# EAGLE board surfaceRX (EAGLE 6.2), part 1 of 2
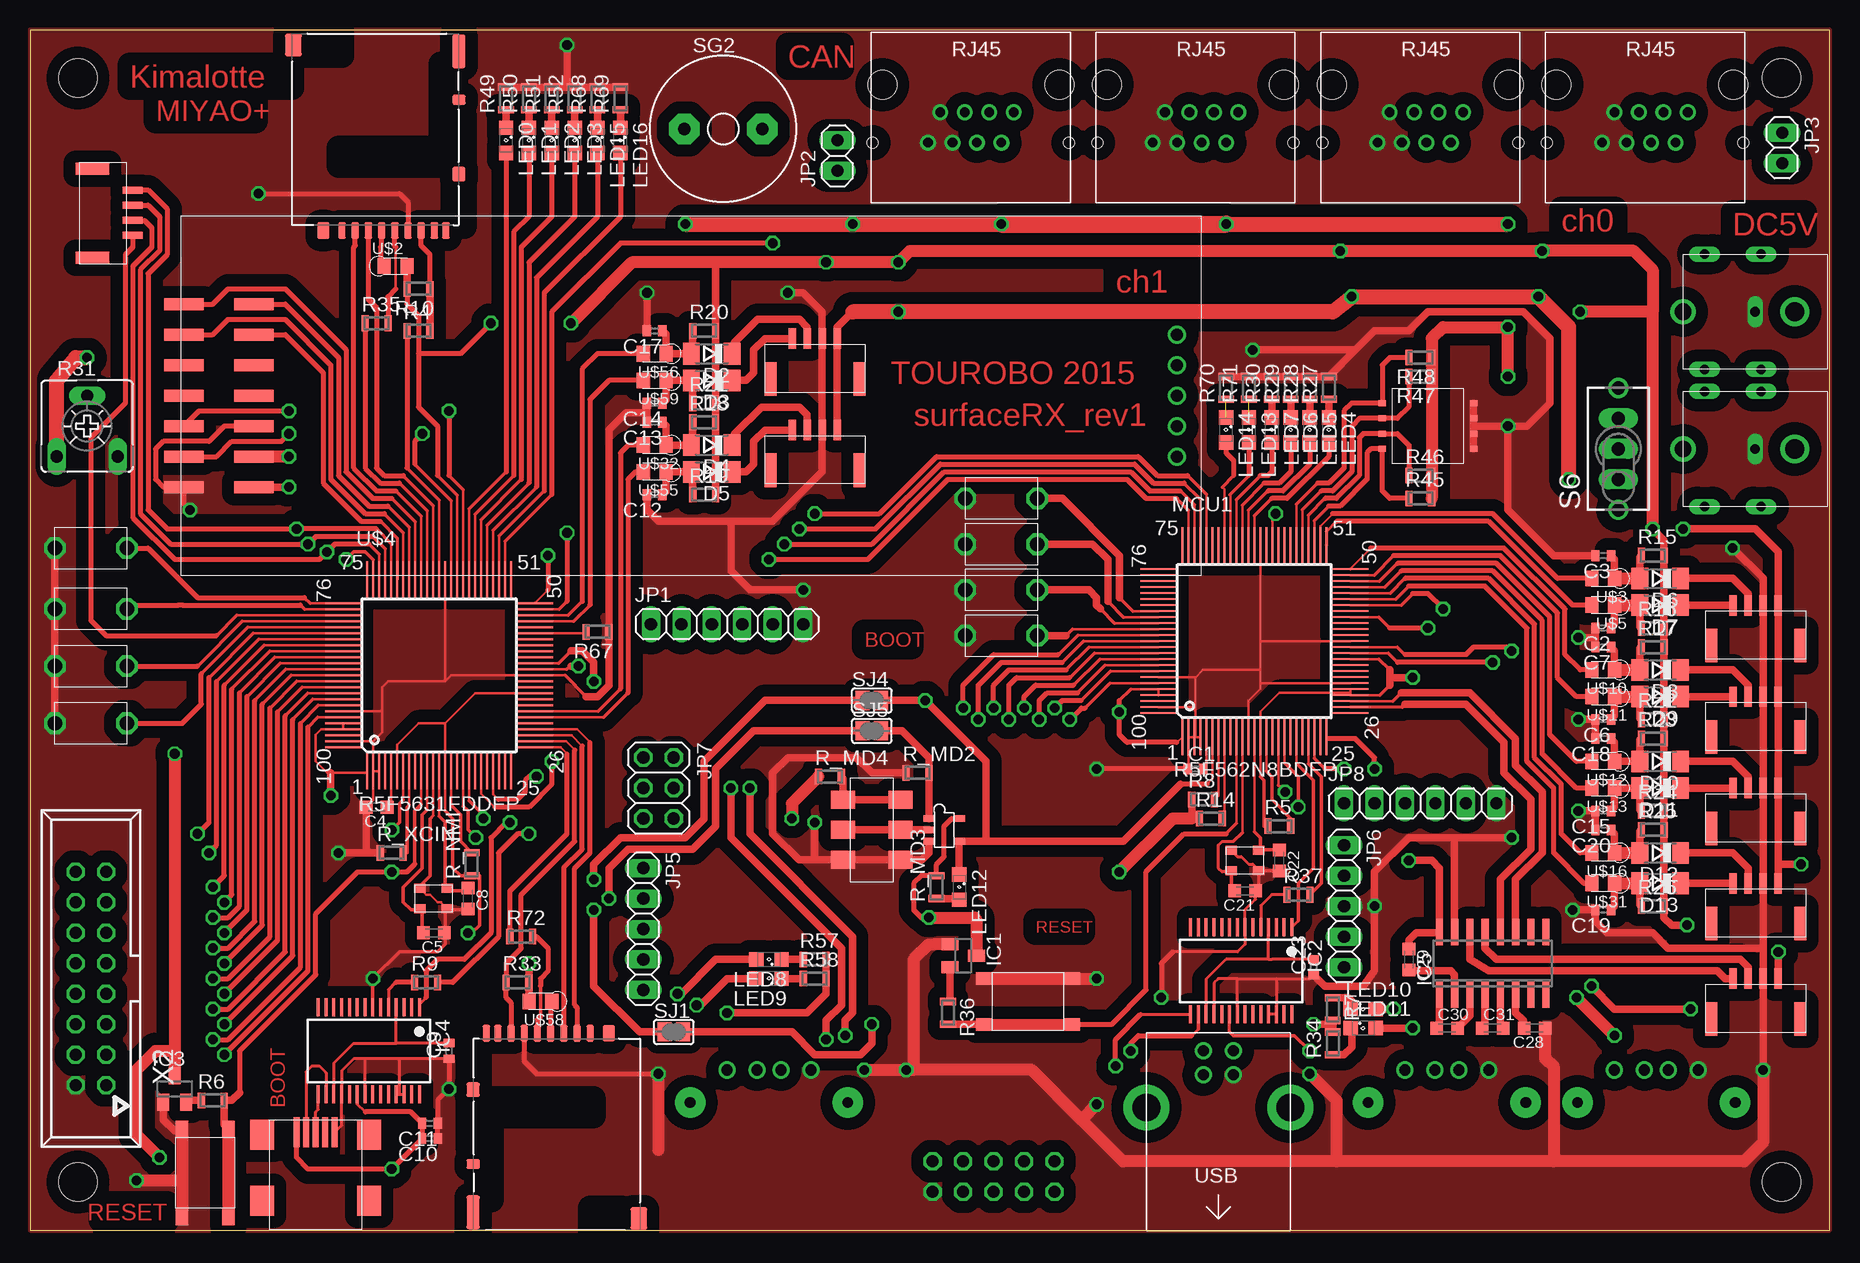
[diagram p2: board, top side]
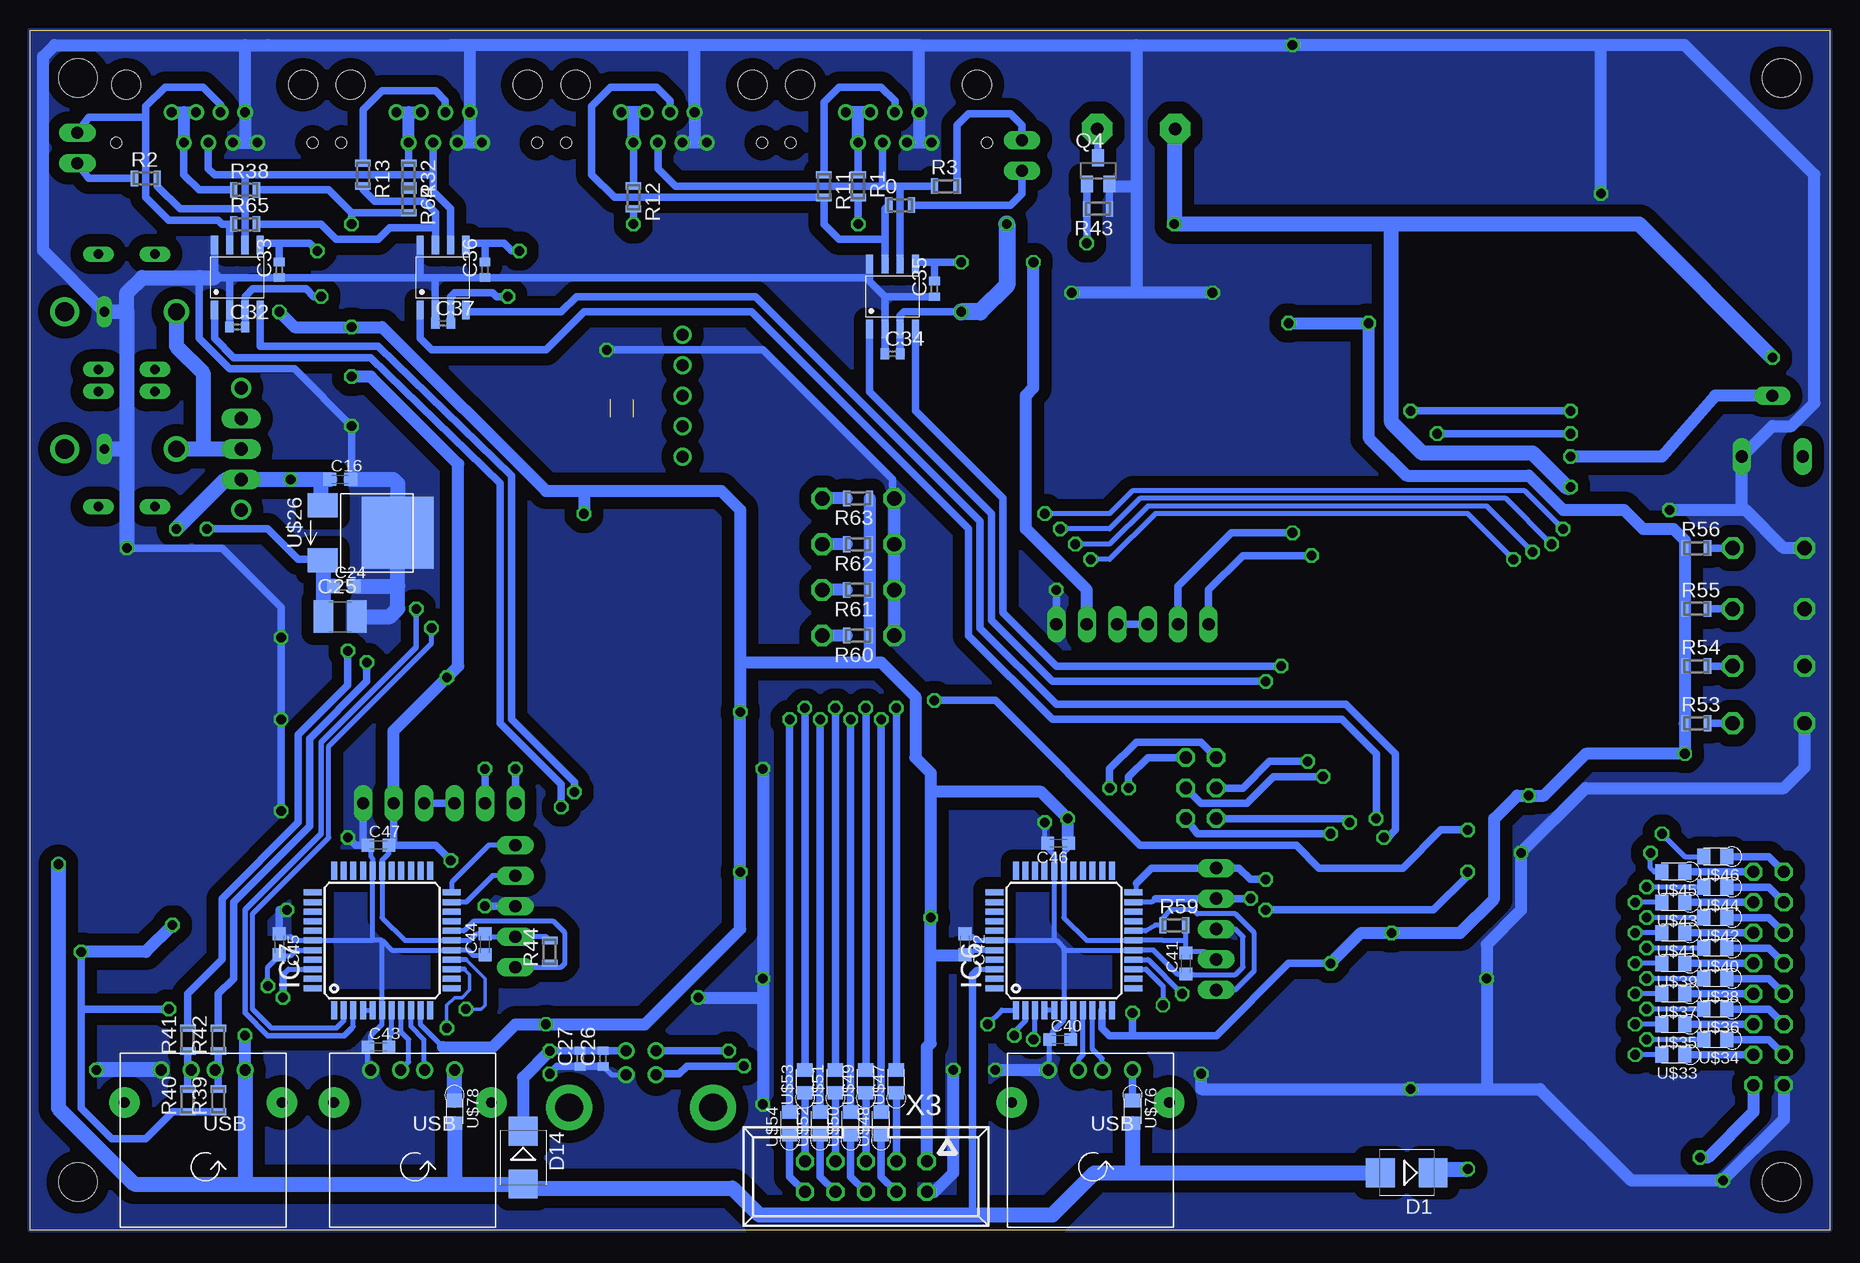
[diagram p3: board, bottom side, seen from below]

Size 150 x 100 mm. Coordinates in mm from the lower left corner, seen from the top.
Outline: 0,0 150,0 150,100 0,100 0,0
Copper layers (1*16): Top 0.035mm / dielectric 1.5mm / Bottom 0.035mm
Design rules "default": minimum track width 0.2mm, minimum drill 24mil, track to track 8mil, track to pad 8mil, pad to pad 8mil, via to via 8mil, smd to smd 0mil, copper to edge 0mil, drill to drill 8mil, minimum pad ring 10mil, minimum via ring 8mil, stop-mask expansion 4mil, vias tented up to drill 0mil, thermal gap 10mil
Holes 3.2 mm at 4,96 4,4 146,4 146,96

## Footprints (pad centres in the part's own frame; a part is rotated, then mirrored left to right if it is on the bottom)
MINI_MELF-0102W = smd 0.6 x 1.3: 1 -0.95,0; 2 0.95,0
C0402 = smd 0.7 x 0.9: 1 -0.65,0; 2 0.65,0
C0603K = smd 1.05 x 1.08: 1 -0.875,0; 2 0.875,0
C3225 = smd 1.6 x 2.7: 1 -1.4,0; 2 1.4,0
SMB = smd 2.4 x 2.4: A 2.2,0; C -2.2,0
SOD80C = smd 1.4 x 1.8: A 1.7,0; C -1.7,0
SOT23B-3 = smd 1 x 1.4: 1 -0.95,-1.1; 2 0.95,-1.1; 3 0,1.1
SSOP28 = smd 0.25 x 1.5: 1 -4.225,-3.625; 2 -3.575,-3.625; 3 -2.925,-3.625; 4 -2.275,-3.625; 5 -1.625,-3.625; 6 -0.975,-3.625; 7 -0.325,-3.625; 8 0.325,-3.625; 9 0.975,-3.625; 10 1.625,-3.625; 11 2.275,-3.625; 12 2.925,-3.625; 13 3.575,-3.625; 14 4.225,-3.625; 15 4.225,3.625; 16 3.575,3.625; 17 2.925,3.625; 18 2.275,3.625; 19 1.625,3.625; 20 0.975,3.625; 21 0.325,3.625; 22 -0.325,3.625; 23 -0.975,3.625; 24 -1.625,3.625; 25 -2.275,3.625; 26 -2.925,3.625; 27 -3.575,3.625; 28 -4.225,3.625
SO16 = smd 0.6 x 2.2: 1 -4.445,-2.6; 2 -3.175,-2.6; 3 -1.905,-2.6; 4 -0.635,-2.6; 5 0.635,-2.6; 6 1.905,-2.6; 7 3.175,-2.6; 8 4.445,-2.6; 9 4.445,2.6; 10 3.175,2.6; 11 1.905,2.6; 12 0.635,2.6; 13 -0.635,2.6; 14 -1.905,2.6; 15 -3.175,2.6; 16 -4.445,2.6
TQFP44 = smd 1.5 x 0.5: 1 -5.8,4; 2 -5.8,3.2; 3 -5.8,2.4; 4 -5.8,1.6; 5 -5.8,0.8; 6 -5.8,0; 7 -5.8,-0.8; 8 -5.8,-1.6; 9 -5.8,-2.4; 10 -5.8,-3.2; 11 -5.8,-4; 23 5.8,-4; 24 5.8,-3.2; 25 5.8,-2.4; 26 5.8,-1.6; 27 5.8,-0.8; 28 5.8,0; 29 5.8,0.8; 30 5.8,1.6; 31 5.8,2.4; 32 5.8,3.2; 33 5.8,4 | smd 0.5 x 1.5: 12 -4,-5.8; 13 -3.2,-5.8; 14 -2.4,-5.8; 15 -1.6,-5.8; 16 -0.8,-5.8; 17 0,-5.8; 18 0.8,-5.8; 19 1.6,-5.8; 20 2.4,-5.8; 21 3.2,-5.8; 22 4,-5.8; 34 4,5.8; 35 3.2,5.8; 36 2.4,5.8; 37 1.6,5.8; 38 0.8,5.8; 39 0,5.8; 40 -0.8,5.8; 41 -1.6,5.8; 42 -2.4,5.8; 43 -3.2,5.8; 44 -4,5.8
1X06 = drill 1.016 long: 1 -6.35,0; 2 -3.81,0; 3 -1.27,0; 4 1.27,0; 5 3.81,0; 6 6.35,0
1X02 = drill 1.016 long: 1 -1.27,0; 2 1.27,0
1X05 = drill 1.016 long: 1 -5.08,0; 2 -2.54,0; 3 0,0; 4 2.54,0; 5 5.08,0
2X03 = drill 1.016 octagon: 1 -2.54,-1.27; 2 -2.54,1.27; 3 0,-1.27; 4 0,1.27; 5 2.54,-1.27; 6 2.54,1.27
SML0805 = smd 1.2 x 1.2: A 1.05,0; C -1.05,0
LQFP100 = smd 0.15 x 3: 1 -6.5,-7.5; 2 -6,-7.5; 3 -5.5,-7.5; 4 -5,-7.5; 5 -4.5,-7.5; 6 -4,-7.5; 7 -3.5,-7.5; 8 -3,-7.5; 9 -2.5,-7.5; 10 -2,-7.5; 11 -1.5,-7.5; 12 -1,-7.5; 13 -0.5,-7.5; 14 0,-7.5; 15 0.5,-7.5; 16 1,-7.5; 17 1.5,-7.5; 18 2,-7.5; 19 2.5,-7.5; 20 3,-7.5; 21 3.5,-7.5; 22 4,-7.5; 23 4.5,-7.5; 24 5,-7.5; 25 5.5,-7.5; 51 5.5,8.5; 52 5,8.5; 53 4.5,8.5; 54 4,8.5; 55 3.5,8.5; 56 3,8.5; 57 2.5,8.5; 58 2,8.5; 59 1.5,8.5; 60 1,8.5; 61 0.5,8.5; 62 0,8.5; 63 -0.5,8.5; 64 -1,8.5; 65 -1.5,8.5; 66 -2,8.5; 67 -2.5,8.5; 68 -3,8.5; 69 -3.5,8.5; 70 -4,8.5; 71 -4.5,8.5; 72 -5,8.5; 73 -5.5,8.5; 74 -6,8.5; 75 -6.5,8.5 | smd 3 x 0.15: 26 7.5,-5.5; 27 7.5,-5; 28 7.5,-4.5; 29 7.5,-4; 30 7.5,-3.5; 31 7.5,-3; 32 7.5,-2.5; 33 7.5,-2; 34 7.5,-1.5; 35 7.5,-1; 36 7.5,-0.5; 37 7.5,0; 38 7.5,0.5; 39 7.5,1; 40 7.5,1.5; 41 7.5,2; 42 7.5,2.5; 43 7.5,3; 44 7.5,3.5; 45 7.5,4; 46 7.5,4.5; 47 7.5,5; 48 7.5,5.5; 49 7.5,6; 50 7.5,6.5; 76 -8.5,6.5; 77 -8.5,6; 78 -8.5,5.5; 79 -8.5,5; 80 -8.5,4.5; 81 -8.5,4; 82 -8.5,3.5; 83 -8.5,3; 84 -8.5,2.5; 85 -8.5,2; 86 -8.5,1.5; 87 -8.5,1; 88 -8.5,0.5; 89 -8.5,0; 90 -8.5,-0.5; 91 -8.5,-1; 92 -8.5,-1.5; 93 -8.5,-2; 94 -8.5,-2.5; 95 -8.5,-3; 96 -8.5,-3.5; 97 -8.5,-4; 98 -8.5,-4.5; 99 -8.5,-5; 100 -8.5,-5.5
SOT23 = smd 1 x 1.4: 1 -0.95,-1.1; 2 0.95,-1.1; 3 0,1.1
CA6V = drill 1.016 long: A -2.54,-2.54; E 2.54,-2.54; S 0,2.54
TL3XYO = drill 1.1 pad 1.422 long: 1 -2.54,0; 2 0,0; 3 2.54,0 | drill 1.1 pad 1.676: M1 -5.08,0; M2 5.08,0
AL60P = drill 1.016 pad 2.54 octagon: 1 -3.251,0; 2 3.251,0
SJ = smd 1.168 x 1.6: 1 -0.762,0; 2 0.762,0
GHTOP4 = smd 0.6 x 1.7: 1 1.25,4.75; 2 0,4.75; 3 -1.25,4.75; 4 -2.5,4.75 | smd 1 x 2.8: P$1 3.1,1.4; P$2 -4.3,1.4
2012 = smd 1.1 x 1.3: 1 -0.95,0; 2 0.95,0
TSHA-T-2 = smd 1.4 x 1.05: A -3.65,1.925; B 3.65,1.925; C -3.65,-1.925; D 3.65,-1.925
MUSB-5BF02AS-N = smd 0.5 x 2.5: 1 1.6,1.05; 2 0.8,1.05; 3 0,1.05; 4 -0.8,1.05; 5 -1.6,1.05 | smd 2 x 2.5: P$6 4.45,1.25; P$7 -4.45,1.25; P$8 4.45,6.75; P$9 -4.45,6.75
MCP2562 = smd 1.55 x 0.6: 1 -2.7,2.54; 2 -2.7,1.27; 3 -2.7,0; 4 -2.7,-1.27; 5 2.7,-1.27; 6 2.7,0; 7 2.7,1.27; 8 2.7,2.54
RJ45 = drill 0.8: P$1 -3.57,-0.44; P$2 -2.55,2.1; P$3 -1.53,-0.44; P$4 -0.51,2.1; P$5 0.51,-0.44; P$6 1.53,2.1; P$7 2.55,-0.44; P$8 3.57,2.1 | hole 2.4: -7.375,-2.74; 7.375,-2.74 | hole 0.9: -8.175,2.1; 8.175,2.1
2DC-G213-B66 = drill 1.4: 1 0,0 | drill 0.8 long: 2 0,6; P$4 -4.8,6.5; P$5 -4.8,1.8; P$6 4.8,1.8; P$7 4.8,6.5 | drill 1.6: P$3 0,9.3
TO-252-3-L1 = smd 2 x 2.5: 1 -2.3,-4; 3 2.3,-4 | smd 6 x 6: 2 0,2.25
DM3AT-SF-PEJ = smd 0.65 x 1.4: 1 3.2,16.4; 2 2.1,16.4; 3 1,16.4; 4 -0.1,16.4; 5 -1.2,16.4; 6 -2.3,16.4; 7 -3.4,16.4; 8 -4.5,16.4; CD1 -5.45,16.4 | smd 1.1 x 0.8: CD2 -6.55,5.5 | smd 1.1 x 2.8: GND1 -6.55,1.475 | smd 1.4 x 1.9: GND2 7.25,0.95 | smd 1 x 1.4: GND3 4.75,16.4 | smd 1.1 x 1.2: GND4 -6.55,11.7
FA238V = smd 0.95 x 0.75: 1 -1.15,-0.85; 2 1.15,-0.85; 3 1.15,0.85; 4 -1.15,0.85
USB-TYPEB = drill 0.92 pad 1.422: 1 1.25,0; 2 -1.25,0; 3 -1.25,-2; 4 1.25,-2 | drill 2.3 pad 3.81: P$5 -6,-4.71; P$6 6,-4.71
SC1602BBWB_PAD = smd 3.3 x 1: 1 4.064,0; 2 -1.778,0; 3 4.064,2.54; 4 -1.778,2.54; 5 4.064,5.08; 6 -1.778,5.08; 7 4.064,7.62; 8 -1.778,7.62; 9 4.064,10.16; 10 -1.778,10.16; 11 4.064,12.7; 12 -1.778,12.7; 13 4.064,15.24; 14 -1.778,15.24 | drill 1: P$1 81,12.7; P$2 81,10.16; P$3 81,7.62; P$4 81,5.08; P$5 81,2.54
TVBP06 = drill 1.2 octagon: 1 0,3; 2 0,-3
USB_A = drill 0.92: 1 3.5,0; 2 1,0; 3 -1,0; 4 -3.5,0 | drill 0.9 pad 2.54: PAD@1 6.57,-2.71; PAD@2 -6.57,-2.71
SOT23-5 = smd 0.57 x 0.95: 1 -0.95,-1.25; 2 0,-1.25; 3 0.95,-1.25; 4 0.95,1.25; 5 -0.95,1.25
KHS42 = smd 0.5 x 0.6: 1 -1.905,3.81; 2 -0.635,3.81; 3 0.635,3.81; 4 1.905,3.81; 5 -1.905,-3.81; 6 -0.635,-3.81; 7 0.635,-3.81; 8 1.905,-3.81
SSSS2 = smd 1.5 x 2: 1 -2.5,2.4; 2 0,2.4; 3 2.5,2.4; 4 -2.5,-2.4; 5 0,-2.4; 6 2.5,-2.4
057-016-1 = drill 1 octagon: 1 -8.89,-1.27; 2 -8.89,1.27; 3 -6.35,-1.27; 4 -6.35,1.27; 5 -3.81,-1.27; 6 -3.81,1.27; 7 -1.27,-1.27; 8 -1.27,1.27; 9 1.27,-1.27; 10 1.27,1.27; 11 3.81,-1.27; 12 3.81,1.27; 13 6.35,-1.27; 14 6.35,1.27; 15 8.89,-1.27; 16 8.89,1.27
057-010-1 = drill 1 octagon: 1 -5.08,-1.27; 2 -5.08,1.27; 3 -2.54,-1.27; 4 -2.54,1.27; 5 0,-1.27; 6 0,1.27; 7 2.54,-1.27; 8 2.54,1.27; 9 5.08,-1.27; 10 5.08,1.27

## Placement (x,y rotation side)
0  120  [MINI_MELF-0102W]  77.47,85.41 0 bottom
C1  0.1u  [C0402]  97.16,38.42 0 top
C2  0.01u  [C0402]  131.13,50.16 180 top
C3  0.01u  [C0402]  131.13,56.2 180 top
C4  0.1uF  [C0603K]  28.89,35.24 180 top
C5  22p  [C0603K]  33.66,24.77 180 top
C6  0.01u  [C0402]  131.13,42.55 180 top
C7  0.01u  [C0402]  131.13,48.58 180 top
C8  22p  [C0603K]  36.51,27.62 270 top
C9  0.1u  [C0402]  34.92,14.92 90 top
C10  0.1u  [C0402]  33.34,7.62 180 top
C11  0.1u  [C0402]  33.34,8.89 180 top
C12  0.01u  [C0402]  52.07,61.28 180 top
C13  0.01u  [C0402]  52.07,67.31 180 top
C14  0.01u  [C0402]  52.07,68.9 180 top
C15  0.01u  [C0402]  131.13,34.92 180 top
C16  0.1uF  [C0603K]  124.14,62.55 0 bottom
C17  0.01u  [C0402]  52.07,74.93 180 top
C18  0.01u  [C0402]  131.13,40.96 180 top
C19  0.01u  [C0402]  131.13,26.67 180 top
C20  0.01u  [C0402]  131.13,33.34 180 top
C21  22p  [C0603K]  101.28,28.26 180 top
C22  22p  [C0603K]  104.14,30.8 270 top
C23  0.1u  [C0402]  107,21.91 90 top
C24  0.1uF  [C0603K]  123.83,53.66 0 bottom
C25  47u  [C3225]  124.14,51.12 0 bottom
C26  0.1u  [C0402]  102.23,14.29 90 bottom
C27  0.1u  [C0402]  104.14,14.29 90 bottom
C28  0.1uF  [C0603K]  125.41,16.83 180 top
C29  0.1uF  [C0603K]  114.94,22.54 270 top
C30  0.1uF  [C0603K]  118.11,16.83 0 top
C31  0.1uF  [C0603K]  121.92,16.83 0 top
C32  0.1u  [C0402]  132.72,75.25 0 bottom
C33  0.1u  [C0402]  129.22,80.01 90 bottom
C34  0.1u  [C0402]  78.11,73.03 0 bottom
C35  0.1u  [C0402]  74.61,78.42 90 bottom
C36  0.1u  [C0402]  112.08,80.01 90 bottom
C37  0.1u  [C0402]  115.57,75.56 0 bottom
C40  10u  [C0603K]  64.14,15.88 0 bottom
C41  0.1u  [C0603K]  53.66,22.23 90 bottom
C42  0.1u  [C0603K]  72.07,23.81 270 bottom
C43  10u  [C0603K]  120.97,15.24 0 bottom
C44  0.1uu  [C0603K]  112.08,23.81 90 bottom
C45  0.1u  [C0603K]  129.22,23.81 270 bottom
C46  0.1u  [C0603K]  64.29,32.23 180 bottom
C47  0.1u  [C0603K]  120.97,32.07 0 bottom
D1  ES2D  [SMB]  35.24,4.76 180 bottom
D2  PMLL4150  [SOD80C]  56.83,73.03 180 top
D3  PMLL4150  [SOD80C]  56.83,70.8 180 top
D4  PMLL4150  [SOD80C]  56.83,65.41 180 top
D5  PMLL4150  [SOD80C]  56.83,63.18 180 top
D6  PMLL4150  [SOD80C]  135.89,54.29 180 top
D7  PMLL4150  [SOD80C]  135.89,52.07 180 top
D8  PMLL4150  [SOD80C]  135.89,46.67 180 top
D9  PMLL4150  [SOD80C]  135.89,44.45 180 top
D10  PMLL4150  [SOD80C]  135.89,39.05 180 top
D11  PMLL4150  [SOD80C]  135.89,36.83 180 top
D12  PMLL4150  [SOD80C]  135.89,31.43 180 top
D13  PMLL4150  [SOD80C]  135.89,28.89 180 top
D14  ES2D  [SMB]  108.9,6.03 270 bottom
IC1  [SOT23B-3]  77.79,22.86 270 top
IC2  FT232RL  [SSOP28]  100.97,21.59 180 top
IC3  [SOT23B-3]  12.06,11.75 0 top
IC4  FT232RL  [SSOP28]  28.26,14.92 180 top
IC5  ADM3202ARN  [SO16]  121.92,22.23 0 top
IC6  PIC24FJ64GA004  [TQFP44]  63.82,24.13 90 bottom
IC7  PIC24FJ64GA004  [TQFP44]  120.65,24.13 90 bottom
JP1  [1X06]  58.1,50.48 0 top
JP2  [1X02]  67.31,89.53 90 top
JP3  [1X02]  146.05,90.17 270 top
JP5  [1X05]  51.12,25.08 270 top
JP6  [1X05]  109.54,26.99 270 top
JP7  [2X03]  52.39,36.83 270 top
JP8  [1X06]  115.89,35.56 0 top
LED0  [SML0805]  39.69,90.81 270 top
LED1  [SML0805]  41.59,90.81 270 top
LED2  [SML0805]  43.5,90.81 270 top
LED3  [SML0805]  45.4,90.81 270 top
LED4  [SML0805]  108.27,66.67 270 top
LED5  [SML0805]  106.68,66.67 270 top
LED6  [SML0805]  105.09,66.67 270 top
LED7  [SML0805]  103.5,66.67 270 top
LED8  [SML0805]  61.59,22.54 180 top
LED9  [SML0805]  61.59,20.95 180 top
LED10  [SML0805]  111.12,18.41 0 top
LED11  [SML0805]  111.12,16.83 0 top
LED12  [SML0805]  77.47,28.57 270 top
LED13  [SML0805]  101.6,66.67 270 top
LED14  [SML0805]  99.69,66.67 270 top
LED15  [SML0805]  47.31,90.81 270 top
LED16  [SML0805]  49.21,90.81 270 top
MCU1  R5F562N8BDFP  [LQFP100]  102.55,48.58 0 top
Q4  [SOT23]  60.96,88.27 0 bottom
R1  0  [MINI_MELF-0102W]  80.96,87 270 bottom
R2  120  [MINI_MELF-0102W]  140.34,87.63 0 bottom
R3  0  [MINI_MELF-0102W]  73.66,87 0 bottom
R4  0  [MINI_MELF-0102W]  32.38,74.93 0 top
R5  4.7k  [MINI_MELF-0102W]  104.14,33.66 0 top
R6  4.7k  [MINI_MELF-0102W]  15.24,10.79 0 top
R7  1k  [MINI_MELF-0102W]  108.58,18.41 270 top
R8  4.7k  [MINI_MELF-0102W]  97.79,35.88 0 top
R9  0  [MINI_MELF-0102W]  33.02,20.64 0 top
R10  10k  [MINI_MELF-0102W]  32.38,78.42 180 top
R11  0  [MINI_MELF-0102W]  83.82,87 270 bottom
R12  0  [MINI_MELF-0102W]  99.69,86.04 270 bottom
R13  0  [MINI_MELF-0102W]  122.24,87.95 270 bottom
R14  4.7k  [MINI_MELF-0102W]  98.42,34.29 0 top
R15  200  [MINI_MELF-0102W]  135.25,56.2 0 top
R16  200  [MINI_MELF-0102W]  135.25,50.16 0 top
R17  200  [MINI_MELF-0102W]  135.25,48.58 0 top
R18  200  [MINI_MELF-0102W]  56.2,67.31 0 top
R19  200  [MINI_MELF-0102W]  56.2,61.28 0 top
R20  200  [MINI_MELF-0102W]  56.2,74.93 0 top
R21  200  [MINI_MELF-0102W]  56.2,68.9 0 top
R22  200  [MINI_MELF-0102W]  135.25,42.55 0 top
R23  200  [MINI_MELF-0102W]  135.25,40.96 0 top
R24  200  [MINI_MELF-0102W]  135.25,34.92 0 top
R25  200  [MINI_MELF-0102W]  135.25,33.34 0 top
R26  200  [MINI_MELF-0102W]  135.25,26.99 0 top
R27  1k  [MINI_MELF-0102W]  108.27,70.17 90 top
R28  1k  [MINI_MELF-0102W]  106.68,70.17 90 top
R29  1k  [MINI_MELF-0102W]  105.09,70.17 90 top
R30  1k  [MINI_MELF-0102W]  103.5,70.17 90 top
R31  10k  [CA6V]  4.76,66.99 0 top
R32  0  [MINI_MELF-0102W]  118.43,87.95 270 bottom
R33  10k  [MINI_MELF-0102W]  40.64,20.64 0 top
R34  1k  [MINI_MELF-0102W]  108.58,15.56 90 top
R35  0  [MINI_MELF-0102W]  28.89,75.56 0 top
R36  4.7k  [MINI_MELF-0102W]  76.52,18.1 270 top
R37  0  [MINI_MELF-0102W]  105.73,27.94 0 top
R38  0  [MINI_MELF-0102W]  132.08,86.68 0 bottom
R39  15k  [MINI_MELF-0102W]  134.3,10.79 90 bottom
R40  15k  [MINI_MELF-0102W]  136.84,10.79 90 bottom
R41  22  [MINI_MELF-0102W]  136.84,15.88 90 bottom
R42  22  [MINI_MELF-0102W]  134.3,15.88 90 bottom
R43  10k  [MINI_MELF-0102W]  60.96,85.09 180 bottom
R44  10k  [MINI_MELF-0102W]  106.68,23.18 90 bottom
R45  10k  [MINI_MELF-0102W]  115.89,60.96 0 top
R46  10k  [MINI_MELF-0102W]  115.89,62.87 0 top
R47  10k  [MINI_MELF-0102W]  115.89,71.12 180 top
R48  10k  [MINI_MELF-0102W]  115.89,72.71 180 top
R49  1k  [MINI_MELF-0102W]  39.69,94.3 90 top
R50  1k  [MINI_MELF-0102W]  41.59,94.3 90 top
R51  1k  [MINI_MELF-0102W]  43.5,94.3 90 top
R52  1k  [MINI_MELF-0102W]  45.4,94.3 90 top
R53  10k  [MINI_MELF-0102W]  11.11,42.23 0 bottom
R54  10k  [MINI_MELF-0102W]  11.11,46.99 0 bottom
R55  10k  [MINI_MELF-0102W]  11.11,51.75 0 bottom
R56  10k  [MINI_MELF-0102W]  11.11,56.83 0 bottom
R57  1k  [MINI_MELF-0102W]  65.41,22.54 0 top
R58  1k  [MINI_MELF-0102W]  65.41,20.95 0 top
R59  10k  [MINI_MELF-0102W]  54.61,25.4 0 bottom
R60  1k  [MINI_MELF-0102W]  80.96,49.53 180 bottom
R61  1k  [MINI_MELF-0102W]  80.96,53.34 180 bottom
R62  1k  [MINI_MELF-0102W]  80.96,57.15 180 bottom
R63  1k  [MINI_MELF-0102W]  80.96,60.96 180 bottom
R64  0  [MINI_MELF-0102W]  118.43,85.72 270 bottom
R65  0  [MINI_MELF-0102W]  132.08,83.82 0 bottom
R67  10k  [MINI_MELF-0102W]  47.31,49.85 180 top
R68  1k  [MINI_MELF-0102W]  47.31,94.3 90 top
R69  1k  [MINI_MELF-0102W]  49.21,94.3 90 top
R70  1k  [MINI_MELF-0102W]  99.69,70.17 90 top
R71  1k  [MINI_MELF-0102W]  101.6,70.17 90 top
R72  0  [MINI_MELF-0102W]  40.96,24.45 0 top
R_MD2  [MINI_MELF-0102W]  73.98,38.1 0 top
R_MD3  [MINI_MELF-0102W]  75.56,28.57 90 top
R_MD4  [MINI_MELF-0102W]  66.67,37.78 0 top
R_NMI  [MINI_MELF-0102W]  36.83,30.48 90 top
R_XCIN  [MINI_MELF-0102W]  30.16,31.43 0 top
S6  TL32YO  [TL3XYO]  132.4,65.09 90 top
SG2  AL60P  [AL60P]  57.78,91.76 0 top
SJ1  [SJ]  53.66,16.51 0 top
SJ4  [SJ]  70.17,44.13 0 top
SJ5  [SJ]  70.17,41.59 0 top
U$1  GHTOP4  [GHTOP4]  3.81,84.14 270 top
U$2  FB1.25MM  [2012]  30.48,80.33 0 top
U$3  FB1.25MM  [2012]  131.13,54.29 180 top
U$4  R5F5631FDDFP  [LQFP100]  34.61,45.72 0 top
U$5  FB1.25MM  [2012]  131.13,52.07 180 top
U$6  TSHA-T-2  [TSHA-T-2]  14.61,4.76 270 top
U$8  TSHA-T-2  [TSHA-T-2]  83.19,19.05 180 top
U$9  MUSB-5BF02AS-N  [MUSB-5BF02AS-N]  23.81,9.21 180 top
U$10  FB1.25MM  [2012]  131.13,46.67 180 top
U$11  FB1.25MM  [2012]  131.13,44.45 180 top
U$12  FB1.25MM  [2012]  131.13,39.05 180 top
U$13  FB1.25MM  [2012]  131.13,36.83 180 top
U$14  GHTOP4  [GHTOP4]  66.04,61.91 0 top
U$15  GHTOP4  [GHTOP4]  66.04,69.53 0 top
U$16  FB1.25MM  [2012]  131.13,31.43 180 top
U$17  MCP2562  [MCP2562]  77.47,77.79 90 bottom
U$18  RJ45  [RJ45]  78.42,92.71 180 top
U$19  MCP2562  [MCP2562]  114.94,79.38 90 bottom
U$20  RJ45  [RJ45]  134.62,92.71 180 top
U$21  RJ45  [RJ45]  115.89,92.71 180 top
U$22  2DC-G213-B66  [2DC-G213-B66]  137.79,65.09 270 top
U$23  2DC-G213-B66  [2DC-G213-B66]  137.79,76.52 270 top
U$24  GHTOP4  [GHTOP4]  144.46,47.31 0 top
U$25  RJ45  [RJ45]  97.16,92.71 180 top
U$26  NJM2845DL1  [TO-252-3-L1]  121.6,58.1 270 bottom
U$27  GHTOP4  [GHTOP4]  144.46,39.69 0 top
U$28  DM3AT-SF-PEJ  [DM3AT-SF-PEJ]  29.21,99.69 180 top
U$29  GHTOP4  [GHTOP4]  144.46,32.07 0 top
U$30  GHTOP4  [GHTOP4]  144.46,24.13 0 top
U$31  FB1.25MM  [2012]  131.13,28.89 180 top
U$32  FB1.25MM  [2012]  52.07,65.41 180 top
U$33  FB1.25MM  [2012]  13.02,14.61 180 bottom
U$34  FB1.25MM  [2012]  9.53,15.88 180 bottom
U$35  FB1.25MM  [2012]  13.02,17.14 180 bottom
U$36  FB1.25MM  [2012]  9.53,18.41 180 bottom
U$37  FB1.25MM  [2012]  13.02,19.68 180 bottom
U$38  FB1.25MM  [2012]  9.53,20.95 180 bottom
U$39  FB1.25MM  [2012]  13.02,22.23 180 bottom
U$40  FB1.25MM  [2012]  9.53,23.5 180 bottom
U$41  FB1.25MM  [2012]  13.02,24.77 180 bottom
U$42  FB1.25MM  [2012]  9.53,26.04 180 bottom
U$43  FB1.25MM  [2012]  13.02,27.3 180 bottom
U$44  FB1.25MM  [2012]  9.53,28.57 180 bottom
U$45  FB1.25MM  [2012]  13.02,29.84 180 bottom
U$46  FB1.25MM  [2012]  9.53,31.11 180 bottom
U$47  FB1.25MM  [2012]  77.79,12.38 90 bottom
U$48  FB1.25MM  [2012]  79.06,8.89 90 bottom
U$49  FB1.25MM  [2012]  80.33,12.38 90 bottom
U$50  FB1.25MM  [2012]  81.6,8.89 90 bottom
U$51  FB1.25MM  [2012]  82.87,12.38 90 bottom
U$52  FB1.25MM  [2012]  84.14,8.89 90 bottom
U$53  FB1.25MM  [2012]  85.41,12.38 90 bottom
U$54  FB1.25MM  [2012]  86.68,8.89 90 bottom
U$55  FB1.25MM  [2012]  52.07,63.18 180 top
U$56  FB1.25MM  [2012]  52.07,73.03 180 top
U$57  DM3AT-SF-PEJ  [DM3AT-SF-PEJ]  43.5,0 0 top
U$58  FB1.25MM  [2012]  42.55,19.05 180 top
U$59  FB1.25MM  [2012]  52.07,70.8 180 top
U$61  FA238V  [FA238V]  33.66,27.62 180 top
U$62  FA238V  [FA238V]  101.28,30.8 180 top
U$63  USB-TYPEB  [USB-TYPEB]  99.06,14.92 0 top
U$64  MCP2562  [MCP2562]  132.08,79.38 90 bottom
U$65  SC1602BBWB_PAD  [SC1602BBWB_PAD]  14.61,61.91 0 top
U$66  TVBP06  [TVBP06]  5.08,56.83 90 top
U$67  USB_A  [USB_A]  135.57,13.34 0 bottom
U$68  3STATE  [SOT23-5]  76.2,33.34 270 top
U$69  TVBP06  [TVBP06]  5.08,51.75 90 top
U$70  TVBP06  [TVBP06]  5.08,46.99 90 top
U$71  TVBP06  [TVBP06]  5.08,42.23 90 top
U$72  TVBP06  [TVBP06]  80.96,60.96 90 top
U$73  TVBP06  [TVBP06]  80.96,57.15 90 top
U$74  TVBP06  [TVBP06]  80.96,53.34 90 top
U$75  USB_A  [USB_A]  61.59,13.34 0 bottom
U$76  FB1.25MM  [2012]  58.1,9.84 270 bottom
U$77  USB_A  [USB_A]  118.11,13.34 0 bottom
U$78  FB1.25MM  [2012]  114.62,9.84 270 bottom
U$79  KHS42  [KHS42]  116.52,66.99 90 top
U$80  GHTOP4  [GHTOP4]  144.46,16.19 0 top
U$81  TVBP06  [TVBP06]  80.96,49.53 90 top
U$82  SSSS2  [SSSS2]  70.17,33.34 90 top
X2  057-016-1  [057-016-1]  5.08,20.95 90 top
X3  057-010-1  [057-010-1]  80.33,4.45 180 bottom